# Altium project Presence-Module-10A.PrjPcb
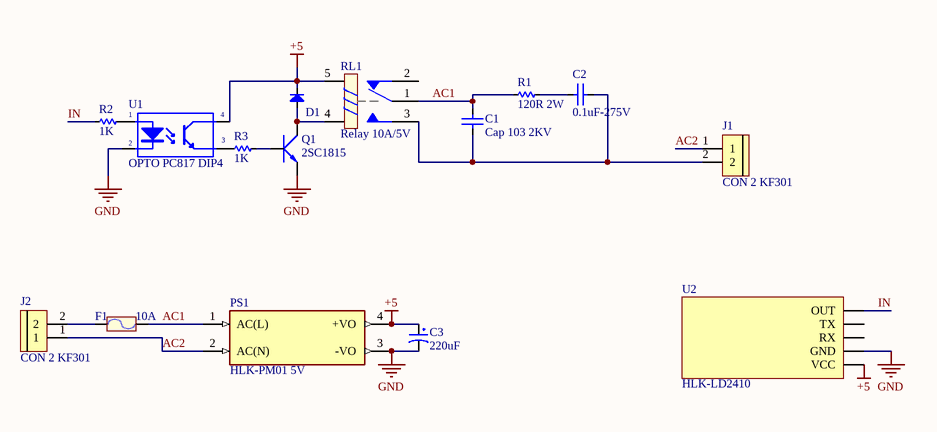
[diagram p0: Sheet1.SchDoc]
1 sheet, 15 parts. Net scope: global (net labels, ports and power ports of the same name join across sheets).
Board file: PCB1.PcbDoc

## Sheet Sheet1.SchDoc
size A; SheetNumber: 1; SheetTotal: 1

### Parts
C1  Cap 103 2KV  [Cap 7.5mm]
C2  0.1uF-275V  [Cap 15mm]
C3  220uF  [Tu hoa 5mm]
D1  Diode  [DIO-1A]  (value not drawn)
F1  10A  [Fuse vertical]
J1  CON 2 KF301  [Con 2 KF301 5.08]
J2  CON 2 KF301  [Con 2 KF301 5.08]
PS1  HLK-PM01 5V  [CONV_HLK-PM01]
Q1  2SC1815  [TO92-123]
R1  120R 2W  [R2WD]
R2  1K  [RES-1/4W]
R3  1K  [RES-1/4W]
RL1  Relay 10A/5V  [RELAY 5]
U1  OPTO PC817 DIP4  [DIP4]
U2  HLK-LD2410  [HLK-LD2410]

### Nets
+5: C3.1 D1.2(K) PS1.4(+VO) RL1.5 U1.4(C) U2.5(VCC)
GND: C3.2 PS1.3(-VO) Q1.1(E) U1.2(K) U2.4(GND)
AC1: C1.1 F1.2 PS1.1(AC(L)) R1.2 RL1.1
AC2: J1.1 J2.1 PS1.2(AC(N))
IN: R2.2 U2.1(OUT)
NetC1_2: C1.2 C2.1 J1.2 RL1.3
NetC2_2: C2.2 R1.1
NetD1_1: D1.1(A) Q1.2(C) RL1.4
NetF1_1: F1.1 J2.2
NetQ1_3: Q1.3(B) R3.1
NetR2_1: R2.1 U1.1(A)
NetR3_2: R3.2 U1.3(E)

Not connected (* = marked no-connect by the designer): RL1 2; U2 2(TX) 3(RX)

### Library data of the parts
C1 = Cap 103 2KV: Capacitor Ceramic 2KV
C2 = CN: Capacitor
C3 = Tu Hoa 220uF 16V 6x11: Cắm; Don_Vi: Con; So_Chan: 2; Ten_Linh_Kien: Tụ Hóa 220uF 16V 6x11MM; Ma_Hang: MH001348; Chung_Loai: Cắm; Kieu_Chan: *
D1 = Diode: Default Diode; Code - JEDEC: DO-214-AB; Value: 1N5007; Published: 8-Jun-2000; Revision: July-2002: Re-released for DXP Platform.; Publisher: Altium Limited
F1 = Fuse: Designed by: VanDungEvn; Value: Fuse
J1 J2 = CON 2 KF301: Cắm; Ma_Hang: MH000987; Ten_Linh_Kien: CON 2 KF301-2P 5.08MM Xanh Dương; Chung_Loai: Cắm; Ghi_Chu: *; Kieu_Chan: *; Don_Vi: Con
PS1 = CONV HLK-PM01: 220VAC to 5V 3W; MF: Hi-link; MP: HLK-20M12; Check_prices: https://www.snapeda.com/parts/HLK-20M12/Hi-link/view-part/?ref=eda; SnapEDA_Link: https://www.snapeda.com/parts/HLK-20M12/Hi-link/view-part/?ref=snap; Availability: Not in stock; Price: None; Value: *; Package: Non-Standard Hi-link
Q1 = 2SC1815: NPN 600mW, ECB; Value: C1815
R1-R3 = Res
RL1 = Relay 5: Relay SPDT,10A - 12VDC 5 Pin; Value: Relay SPDT, 10A, 12V
U1 = OPTO PC817 DIP4: Single Opto; Value: PC817
U2 = HLK-LD2410: HLK-LD2410B-P Cam bien hien dien